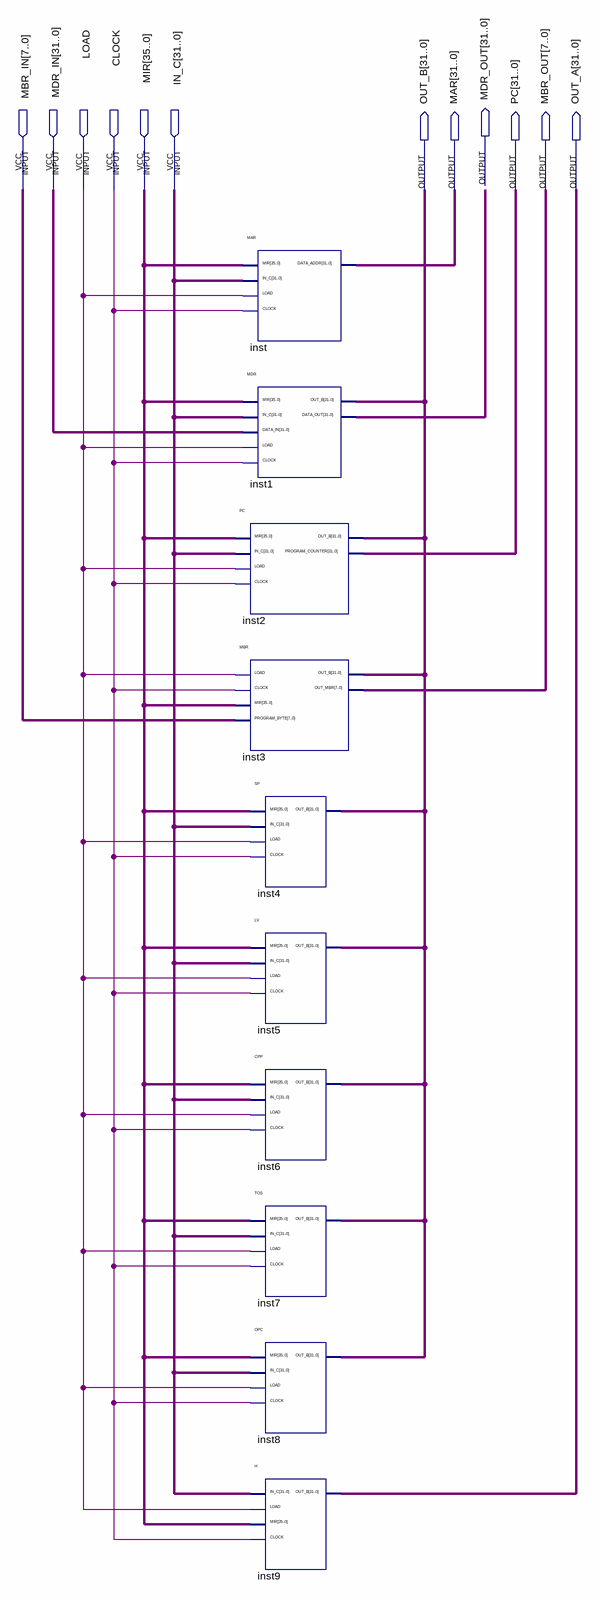
[diagram p0: schematic sheet]
// Quartus schematic bank_regs.bdf as structural Verilog: 10 symbols, 12 pins
module bank_regs (
  input  [7:0] MBR_IN,
  input  [31:0] MDR_IN,
  input  LOAD,
  input  CLOCK,
  input  [35:0] MIR,
  input  [31:0] IN_C,
  output [31:0] OUT_B,
  output [31:0] MAR,
  output [31:0] MDR_OUT,
  output [31:0] PC,
  output [7:0] MBR_OUT,
  output [31:0] OUT_A
);

  MAR inst (.MIR(MIR), .IN_C(IN_C), .LOAD(LOAD), .CLOCK(CLOCK), .DATA_ADDR(MAR));
  MDR inst1 (.MIR(MIR), .IN_C(IN_C), .DATA_IN(MDR_IN), .LOAD(LOAD), .CLOCK(CLOCK), .OUT_B(OUT_B), .DATA_OUT(MDR_OUT));
  PC inst2 (.MIR(MIR), .IN_C(IN_C), .LOAD(LOAD), .CLOCK(CLOCK), .OUT_B(OUT_B), .PROGRAM_COUNTER(PC));
  MBR inst3 (.LOAD(LOAD), .CLOCK(CLOCK), .MIR(MIR), .PROGRAM_BYTE(MBR_IN), .OUT_B(OUT_B), .OUT_MBR(MBR_OUT));
  SP inst4 (.MIR(MIR), .IN_C(IN_C), .LOAD(LOAD), .CLOCK(CLOCK), .OUT_B(OUT_B));
  LV inst5 (.MIR(MIR), .IN_C(IN_C), .LOAD(LOAD), .CLOCK(CLOCK), .OUT_B(OUT_B));
  CPP inst6 (.MIR(MIR), .IN_C(IN_C), .LOAD(LOAD), .CLOCK(CLOCK), .OUT_B(OUT_B));
  TOS inst7 (.MIR(MIR), .IN_C(IN_C), .LOAD(LOAD), .CLOCK(CLOCK), .OUT_B(OUT_B));
  OPC inst8 (.MIR(MIR), .IN_C(IN_C), .LOAD(LOAD), .CLOCK(CLOCK), .OUT_B(OUT_B));
  H inst9 (.IN_C(IN_C), .LOAD(LOAD), .MIR(MIR), .CLOCK(CLOCK), .OUT_B(OUT_A));
endmodule
